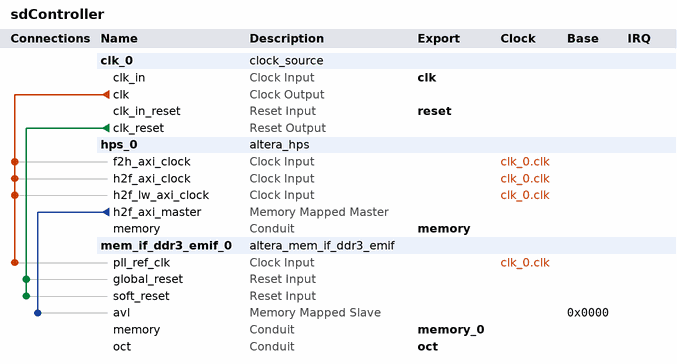
[diagram p0: system contents]
# Platform Designer (Qsys) system sdController, Cyclone V 5CSXFC6D6F31C8ES
# Parameters at their usual value, and those the tool derives, are not listed.
package require -exact qsys 13.0
create_system sdController
set_project_property DEVICE_FAMILY {Cyclone V}
set_project_property DEVICE 5CSXFC6D6F31C8ES

add_instance clk_0 clock_source 13.0
set_instance_parameter_value clk_0 clockFrequency 50000000

add_instance hps_0 altera_hps 13.0.1
set_instance_parameter_value hps_0 MEM_VENDOR JEDEC
set_instance_parameter_value hps_0 MEM_CLK_FREQ_MAX 400.0
set_instance_parameter_value hps_0 MEM_ROW_ADDR_WIDTH 12
set_instance_parameter_value hps_0 MEM_COL_ADDR_WIDTH 8
set_instance_parameter_value hps_0 MEM_DQ_WIDTH 8
set_instance_parameter_value hps_0 MEM_BANKADDR_WIDTH 3
set_instance_parameter_value hps_0 MEM_DRV_STR RZQ/6
set_instance_parameter_value hps_0 MEM_RTT_NOM {ODT Disabled}
set_instance_parameter_value hps_0 MEM_RTT_WR {Dynamic ODT off}
set_instance_parameter_value hps_0 MEM_WTCL 6
set_instance_parameter_value hps_0 MEM_TCL 7
set_instance_parameter_value hps_0 TIMING_TIS 175
set_instance_parameter_value hps_0 TIMING_TIH 250
set_instance_parameter_value hps_0 TIMING_TDS 50
set_instance_parameter_value hps_0 TIMING_TDH 125
set_instance_parameter_value hps_0 TIMING_TDQSQ 120
set_instance_parameter_value hps_0 TIMING_TDQSCK 400
set_instance_parameter_value hps_0 TIMING_TQSH 0.38
set_instance_parameter_value hps_0 MEM_TINIT_US 499
set_instance_parameter_value hps_0 MEM_TMRD_CK 3
set_instance_parameter_value hps_0 MEM_TRAS_NS 40.0
set_instance_parameter_value hps_0 MEM_TRCD_NS 15.0
set_instance_parameter_value hps_0 MEM_TRP_NS 15.0
set_instance_parameter_value hps_0 MEM_TREFI_US 7.0
set_instance_parameter_value hps_0 MEM_TRFC_NS 75.0
set_instance_parameter_value hps_0 MEM_TWTR 2
set_instance_parameter_value hps_0 MEM_TFAW_NS 37.5
set_instance_parameter_value hps_0 REF_CLK_FREQ 125.0
set_instance_parameter_value hps_0 DEFAULT_FAST_SIM_MODEL true
set_instance_parameter_value hps_0 TIMING_BOARD_MAX_CK_DELAY 0.6
set_instance_parameter_value hps_0 TIMING_BOARD_MAX_DQS_DELAY 0.6
set_instance_parameter_value hps_0 TIMING_BOARD_SKEW_CKDQS_DIMM_MIN -0.01
set_instance_parameter_value hps_0 TIMING_BOARD_SKEW_CKDQS_DIMM_MAX 0.01
set_instance_parameter_value hps_0 TIMING_BOARD_SKEW_WITHIN_DQS 0.02
set_instance_parameter_value hps_0 TIMING_BOARD_SKEW_BETWEEN_DQS 0.02
set_instance_parameter_value hps_0 TIMING_BOARD_DQ_TO_DQS_SKEW 0.0
set_instance_parameter_value hps_0 TIMING_BOARD_AC_SKEW 0.02
set_instance_parameter_value hps_0 TIMING_BOARD_AC_TO_CK_SKEW 0.0
set_instance_parameter_value hps_0 MEM_CLK_FREQ 350.0
set_instance_parameter_value hps_0 HPS_PROTOCOL DDR3
set_instance_parameter_value hps_0 STM_Enable false
set_instance_parameter_value hps_0 F2S_Width 2
set_instance_parameter_value hps_0 S2F_Width 2
set_instance_parameter_value hps_0 LWH2F_Enable true
set_instance_parameter_value hps_0 F2SCLK_DBGRST_Enable false
set_instance_parameter_value hps_0 F2SCLK_WARMRST_Enable false
set_instance_parameter_value hps_0 F2SCLK_COLDRST_Enable false
set_instance_parameter_value hps_0 F2SINTERRUPT_Enable false
set_instance_parameter_value hps_0 EMAC1_PinMuxing Unused
set_instance_parameter_value hps_0 EMAC1_Mode N/A
set_instance_parameter_value hps_0 QSPI_PinMuxing Unused
set_instance_parameter_value hps_0 QSPI_Mode N/A
set_instance_parameter_value hps_0 SDIO_PinMuxing Unused
set_instance_parameter_value hps_0 SDIO_Mode N/A
set_instance_parameter_value hps_0 USB1_PinMuxing Unused
set_instance_parameter_value hps_0 USB1_Mode N/A
set_instance_parameter_value hps_0 SPIM1_PinMuxing Unused
set_instance_parameter_value hps_0 SPIM1_Mode N/A
set_instance_parameter_value hps_0 UART0_PinMuxing Unused
set_instance_parameter_value hps_0 UART0_Mode N/A
set_instance_parameter_value hps_0 I2C0_PinMuxing Unused
set_instance_parameter_value hps_0 I2C0_Mode N/A
set_instance_parameter_value hps_0 I2C1_PinMuxing Unused
set_instance_parameter_value hps_0 I2C1_Mode N/A
set_instance_parameter_value hps_0 S2FCLK_USER1CLK_FREQ 100
set_instance_parameter_value hps_0 FPGA_PERIPHERAL_OUTPUT_CLOCK_FREQ_EMAC0_MD_CLK 100
set_instance_parameter_value hps_0 FPGA_PERIPHERAL_OUTPUT_CLOCK_FREQ_EMAC0_GTX_CLK 100
set_instance_parameter_value hps_0 FPGA_PERIPHERAL_OUTPUT_CLOCK_FREQ_EMAC1_MD_CLK 100
set_instance_parameter_value hps_0 FPGA_PERIPHERAL_OUTPUT_CLOCK_FREQ_EMAC1_GTX_CLK 100
set_instance_parameter_value hps_0 quartus_ini_hps_ip_enable_loanio false

add_instance mem_if_ddr3_emif_0 altera_mem_if_ddr3_emif 13.0
set_instance_parameter_value mem_if_ddr3_emif_0 MEM_VENDOR JEDEC
set_instance_parameter_value mem_if_ddr3_emif_0 MEM_FORMAT DISCRETE
set_instance_parameter_value mem_if_ddr3_emif_0 MEM_CLK_FREQ_MAX 400.0
set_instance_parameter_value mem_if_ddr3_emif_0 MEM_ROW_ADDR_WIDTH 12
set_instance_parameter_value mem_if_ddr3_emif_0 MEM_COL_ADDR_WIDTH 8
set_instance_parameter_value mem_if_ddr3_emif_0 MEM_DQ_WIDTH 8
set_instance_parameter_value mem_if_ddr3_emif_0 MEM_BANKADDR_WIDTH 3
set_instance_parameter_value mem_if_ddr3_emif_0 MEM_DRV_STR RZQ/6
set_instance_parameter_value mem_if_ddr3_emif_0 MEM_RTT_NOM {ODT Disabled}
set_instance_parameter_value mem_if_ddr3_emif_0 MEM_RTT_WR {Dynamic ODT off}
set_instance_parameter_value mem_if_ddr3_emif_0 MEM_WTCL 6
set_instance_parameter_value mem_if_ddr3_emif_0 MEM_TCL 7
set_instance_parameter_value mem_if_ddr3_emif_0 TIMING_TIS 175
set_instance_parameter_value mem_if_ddr3_emif_0 TIMING_TIH 250
set_instance_parameter_value mem_if_ddr3_emif_0 TIMING_TDS 50
set_instance_parameter_value mem_if_ddr3_emif_0 TIMING_TDH 125
set_instance_parameter_value mem_if_ddr3_emif_0 TIMING_TDQSQ 120
set_instance_parameter_value mem_if_ddr3_emif_0 TIMING_TDQSCK 400
set_instance_parameter_value mem_if_ddr3_emif_0 TIMING_TDQSS 0.25
set_instance_parameter_value mem_if_ddr3_emif_0 TIMING_TQSH 0.38
set_instance_parameter_value mem_if_ddr3_emif_0 TIMING_TDSH 0.2
set_instance_parameter_value mem_if_ddr3_emif_0 TIMING_TDSS 0.2
set_instance_parameter_value mem_if_ddr3_emif_0 MEM_TINIT_US 499
set_instance_parameter_value mem_if_ddr3_emif_0 MEM_TMRD_CK 3
set_instance_parameter_value mem_if_ddr3_emif_0 MEM_TRAS_NS 40.0
set_instance_parameter_value mem_if_ddr3_emif_0 MEM_TRCD_NS 15.0
set_instance_parameter_value mem_if_ddr3_emif_0 MEM_TRP_NS 15.0
set_instance_parameter_value mem_if_ddr3_emif_0 MEM_TREFI_US 7.0
set_instance_parameter_value mem_if_ddr3_emif_0 MEM_TRFC_NS 75.0
set_instance_parameter_value mem_if_ddr3_emif_0 MEM_TWTR 2
set_instance_parameter_value mem_if_ddr3_emif_0 MEM_TFAW_NS 37.5
set_instance_parameter_value mem_if_ddr3_emif_0 MEM_TRRD_NS 7.5
set_instance_parameter_value mem_if_ddr3_emif_0 MEM_TRTP_NS 7.5
set_instance_parameter_value mem_if_ddr3_emif_0 RATE Half
set_instance_parameter_value mem_if_ddr3_emif_0 MEM_CLK_FREQ 350.0
set_instance_parameter_value mem_if_ddr3_emif_0 SPEED_GRADE 6
set_instance_parameter_value mem_if_ddr3_emif_0 HARD_EMIF false
set_instance_parameter_value mem_if_ddr3_emif_0 POWER_OF_TWO_BUS false
set_instance_parameter_value mem_if_ddr3_emif_0 AVL_MAX_SIZE 4
set_instance_parameter_value mem_if_ddr3_emif_0 PRIORITY_PORT 1,1,1,1,1,1
set_instance_parameter_value mem_if_ddr3_emif_0 CPORT_TYPE_PORT Bidirectional,Bidirectional,Bidirectional,Bidirectional,Bidirectional,Bidirectional
set_instance_parameter_value mem_if_ddr3_emif_0 REF_CLK_FREQ 125.0
set_instance_parameter_value mem_if_ddr3_emif_0 DEFAULT_FAST_SIM_MODEL true
set_instance_parameter_value mem_if_ddr3_emif_0 EXPORT_AFI_HALF_CLK false
set_instance_parameter_value mem_if_ddr3_emif_0 PLL_LOCATION Top_Bottom
set_instance_parameter_value mem_if_ddr3_emif_0 CALIBRATION_MODE Skip
set_instance_parameter_value mem_if_ddr3_emif_0 USER_DEBUG_LEVEL 1
set_instance_parameter_value mem_if_ddr3_emif_0 TIMING_BOARD_MAX_CK_DELAY 0.6
set_instance_parameter_value mem_if_ddr3_emif_0 TIMING_BOARD_MAX_DQS_DELAY 0.6
set_instance_parameter_value mem_if_ddr3_emif_0 TIMING_BOARD_SKEW_CKDQS_DIMM_MIN -0.01
set_instance_parameter_value mem_if_ddr3_emif_0 TIMING_BOARD_SKEW_CKDQS_DIMM_MAX 0.01
set_instance_parameter_value mem_if_ddr3_emif_0 TIMING_BOARD_SKEW_WITHIN_DQS 0.02
set_instance_parameter_value mem_if_ddr3_emif_0 TIMING_BOARD_SKEW_BETWEEN_DQS 0.02
set_instance_parameter_value mem_if_ddr3_emif_0 TIMING_BOARD_DQ_TO_DQS_SKEW 0.0
set_instance_parameter_value mem_if_ddr3_emif_0 TIMING_BOARD_AC_SKEW 0.02
set_instance_parameter_value mem_if_ddr3_emif_0 TIMING_BOARD_AC_TO_CK_SKEW 0.0

# connections
add_connection clk_0.clk hps_0.f2h_axi_clock clock
add_connection clk_0.clk hps_0.h2f_axi_clock clock
add_connection clk_0.clk hps_0.h2f_lw_axi_clock clock
add_connection clk_0.clk mem_if_ddr3_emif_0.pll_ref_clk clock
add_connection clk_0.clk_reset mem_if_ddr3_emif_0.global_reset reset
add_connection clk_0.clk_reset mem_if_ddr3_emif_0.soft_reset reset
add_connection hps_0.h2f_axi_master mem_if_ddr3_emif_0.avl avalon
set_connection_parameter_value hps_0.h2f_axi_master/mem_if_ddr3_emif_0.avl baseAddress 0x0000

# exported interfaces
add_interface clk clock sink
set_interface_property clk EXPORT_OF clk_0.clk_in
add_interface reset reset sink
set_interface_property reset EXPORT_OF clk_0.clk_in_reset
add_interface memory conduit end
set_interface_property memory EXPORT_OF hps_0.memory
add_interface memory_0 conduit end
set_interface_property memory_0 EXPORT_OF mem_if_ddr3_emif_0.memory
add_interface oct conduit end
set_interface_property oct EXPORT_OF mem_if_ddr3_emif_0.oct

set_interconnect_requirement {$system} qsys_mm.clockCrossingAdapter HANDSHAKE
set_interconnect_requirement {$system} qsys_mm.maxAdditionalLatency 1

save_system sdController.qsys
